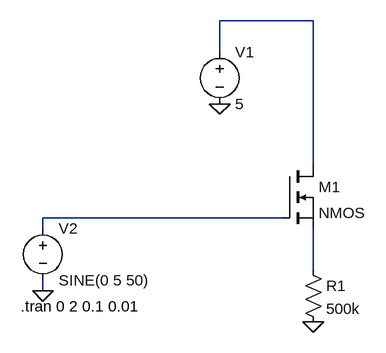
[diagram p0: schematic Circuit2.asc]
Circuit2.asc, the LTspice schematic file:
Version 4
SHEET 1 880 680
WIRE 240 -80 96 -80
WIRE 96 -32 96 -80
WIRE 240 144 240 -80
WIRE 192 224 -176 224
WIRE -176 240 -176 224
WIRE 240 304 240 240
WIRE -176 336 -176 320
FLAG 96 48 0
FLAG -176 336 0
FLAG 240 384 0
SYMBOL nmos 192 144 R0
SYMATTR InstName M1
SYMBOL voltage 96 -48 R0
WINDOW 123 0 0 Left 0
WINDOW 39 0 0 Left 0
SYMATTR InstName V1
SYMATTR Value 5
SYMBOL voltage -176 224 R0
WINDOW 123 0 0 Left 0
WINDOW 39 0 0 Left 0
SYMATTR InstName V2
SYMATTR Value SINE(0 5 50)
SYMBOL res 224 288 R0
SYMATTR InstName R1
SYMATTR Value 500k
TEXT -210 360 Left 2 !.tran 0 2 0.1 0.01

The netlist it stands for:
* Circuit2.asc
M1 N001 N002 N003 N003 NMOS
V1 N001 0 5
V2 N002 0 SINE(0 5 50)
R1 N003 0 500k
.model NMOS NMOS
.model PMOS PMOS
.lib standard.mos
.tran 0 2 0.1 0.01
.backanno
.end